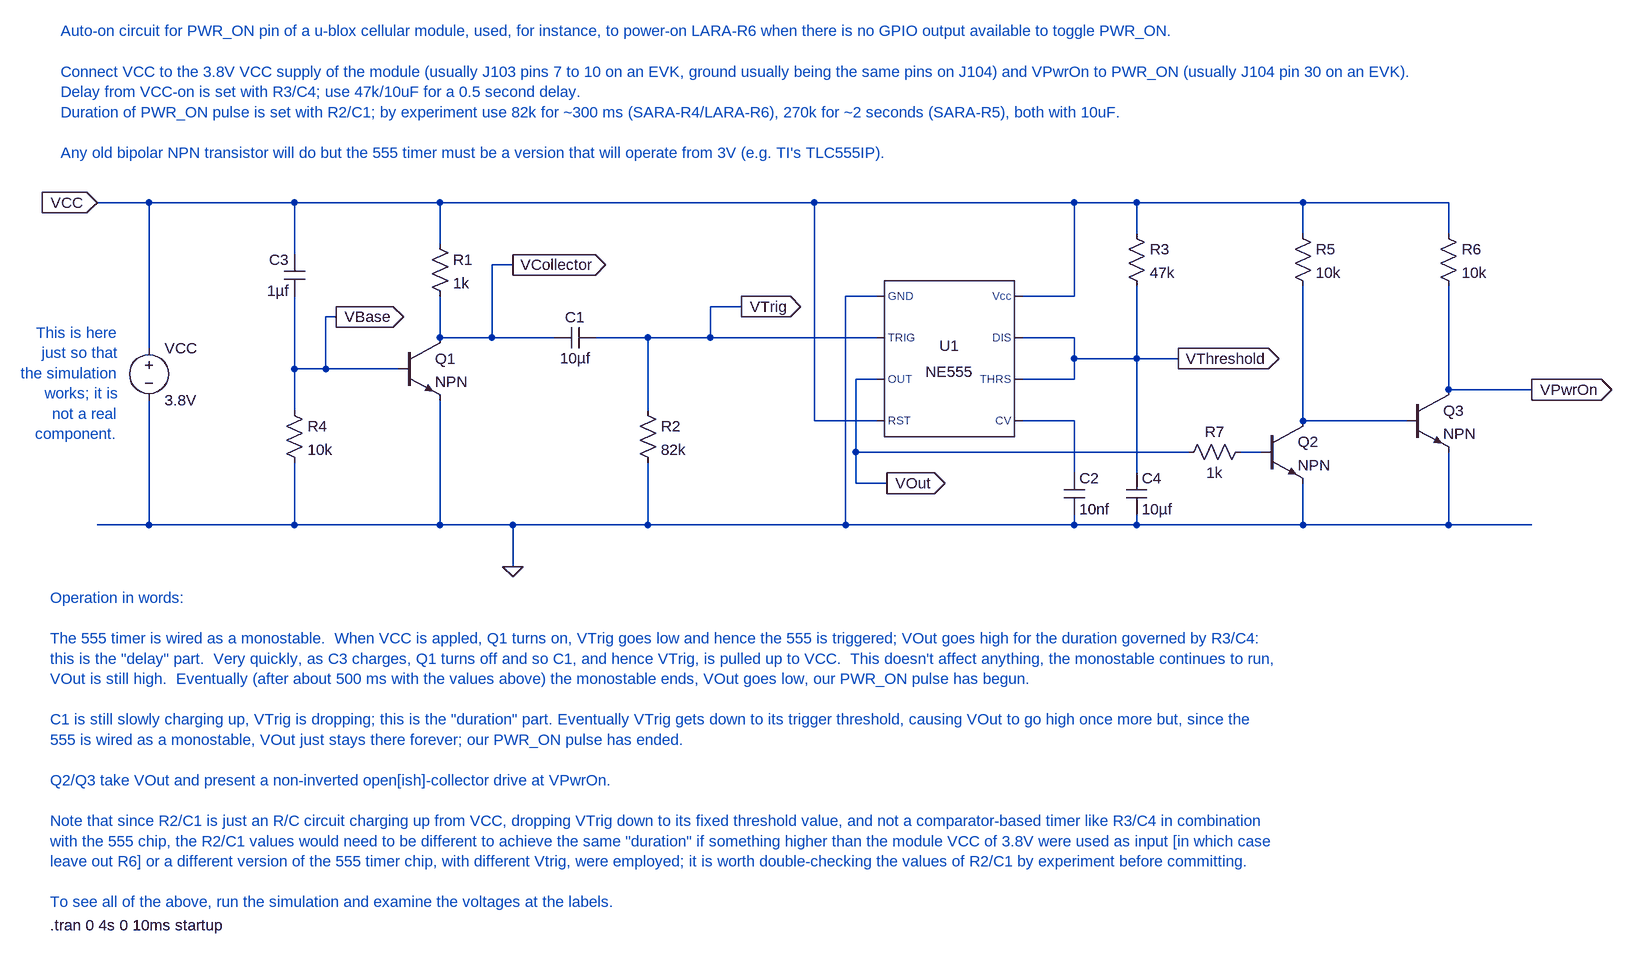
[diagram p0: schematic cellular_auto_pwr_on_schematic.asc]
cellular_auto_pwr_on_schematic.asc, the LTspice schematic file:
Version 4
SHEET 1 2436 1064
WIRE -288 -64 -368 -64
WIRE -64 -64 -288 -64
WIRE 160 -64 -64 -64
WIRE 736 -64 160 -64
WIRE 1136 -64 736 -64
WIRE 1232 -64 1136 -64
WIRE 1488 -64 1232 -64
WIRE 1712 -64 1488 -64
WIRE 1232 -16 1232 -64
WIRE 1488 -16 1488 -64
WIRE 1712 -16 1712 -64
WIRE 160 0 160 -64
WIRE -64 16 -64 -64
WIRE 272 32 240 32
WIRE 832 80 784 80
WIRE 1136 80 1136 -64
WIRE 1136 80 1056 80
WIRE 624 96 576 96
WIRE 0 112 -16 112
WIRE 160 144 160 80
WIRE 240 144 240 32
WIRE 240 144 160 144
WIRE 336 144 240 144
WIRE 480 144 400 144
WIRE 576 144 576 96
WIRE 576 144 480 144
WIRE 832 144 576 144
WIRE 1136 144 1056 144
WIRE -288 160 -288 -64
WIRE 1136 176 1136 144
WIRE 1232 176 1232 64
WIRE 1232 176 1136 176
WIRE 1296 176 1232 176
WIRE -64 192 -64 80
WIRE -16 192 -16 112
WIRE -16 192 -64 192
WIRE 96 192 -16 192
WIRE 832 208 800 208
WIRE 1136 208 1136 176
WIRE 1136 208 1056 208
WIRE 1712 224 1712 64
WIRE 1840 224 1712 224
WIRE -64 256 -64 192
WIRE 480 256 480 144
WIRE 736 272 736 -64
WIRE 832 272 736 272
WIRE 1136 272 1056 272
WIRE 1488 272 1488 64
WIRE 1648 272 1488 272
WIRE 800 320 800 208
WIRE 1312 320 800 320
WIRE 1424 320 1392 320
WIRE 1136 352 1136 272
WIRE 1232 352 1232 176
WIRE 800 368 800 320
WIRE 848 368 800 368
WIRE -288 432 -288 240
WIRE -288 432 -368 432
WIRE -64 432 -64 336
WIRE -64 432 -288 432
WIRE 160 432 160 240
WIRE 160 432 -64 432
WIRE 272 432 160 432
WIRE 480 432 480 336
WIRE 480 432 272 432
WIRE 784 432 784 80
WIRE 784 432 480 432
WIRE 1136 432 1136 416
WIRE 1136 432 784 432
WIRE 1232 432 1232 416
WIRE 1232 432 1136 432
WIRE 1488 432 1488 368
WIRE 1488 432 1232 432
WIRE 1712 432 1712 320
WIRE 1712 432 1488 432
WIRE 1840 432 1712 432
WIRE 272 496 272 432
FLAG 272 496 0
FLAG -368 -64 VCC
IOPIN -368 -64 In
FLAG 1840 224 VPwrOn
IOPIN 1840 224 Out
FLAG 624 96 VTrig
IOPIN 624 96 Out
FLAG 272 32 VCollector
IOPIN 272 32 Out
FLAG 1296 176 VThreshold
IOPIN 1296 176 Out
FLAG 0 112 VBase
IOPIN 0 112 Out
FLAG 848 368 VOut
IOPIN 848 368 Out
SYMBOL npn 96 144 R0
SYMATTR InstName Q1
SYMBOL cap 400 128 R90
WINDOW 0 0 32 VBottom 2
WINDOW 3 32 32 VTop 2
SYMATTR InstName C1
SYMATTR Value 10µf
SYMBOL res 144 -16 R0
SYMATTR InstName R1
SYMATTR Value 1k
SYMBOL res -80 240 R0
SYMATTR InstName R4
SYMATTR Value 10k
SYMBOL voltage -288 144 R0
WINDOW 123 0 0 Left 0
WINDOW 39 24 124 Left 2
SYMATTR InstName VCC
SYMATTR Value 3.8V
SYMBOL cap -48 80 R180
WINDOW 0 24 56 Left 2
WINDOW 3 24 8 Left 2
SYMATTR InstName C3
SYMATTR Value 1µf
SYMBOL res 464 240 R0
SYMATTR InstName R2
SYMATTR Value 82k
SYMBOL Misc\\NE555 944 176 R0
SYMATTR InstName U1
SYMBOL cap 1120 352 R0
SYMATTR InstName C2
SYMATTR Value 10nf
SYMBOL res 1216 -32 R0
SYMATTR InstName R3
SYMATTR Value 47k
SYMBOL cap 1216 352 R0
SYMATTR InstName C4
SYMATTR Value 10µf
SYMBOL npn 1424 272 R0
SYMATTR InstName Q2
SYMBOL res 1472 -32 R0
SYMATTR InstName R5
SYMATTR Value 10k
SYMBOL npn 1648 224 R0
SYMATTR InstName Q3
SYMBOL res 1696 -32 R0
SYMATTR InstName R6
SYMATTR Value 10k
SYMBOL res 1408 304 R90
WINDOW 0 0 56 VBottom 2
WINDOW 3 32 56 VTop 2
SYMATTR InstName R7
SYMATTR Value 1k
TEXT -440 1048 Left 2 !.tran 0 4s 0 10ms startup
TEXT -424 -328 Left 2 ;Auto-on circuit for PWR_ON pin of a u-blox cellular module, used, for instance, to power-on LARA-R6 when there is no GPIO output available to toggle PWR_ON.\n \nConnect VCC to the 3.8V VCC supply of the module (usually J103 pins 7 to 10 on an EVK, ground usually being the same pins on J104) and VPwrOn to PWR_ON (usually J104 pin 30 on an EVK).\nDelay from VCC-on is set with R3/C4; use 47k/10uF for a 0.5 second delay.\nDuration of PWR_ON pulse is set with R2/C1; by experiment use 82k for ~300 ms (SARA-R4/LARA-R6), 270k for ~2 seconds (SARA-R5), both with 10uF.\n \nAny old bipolar NPN transistor will do but the 555 timer must be a version that will operate from 3V (e.g. TI's TLC555IP).
TEXT -440 544 Left 2 ;Operation in words:\n \nThe 555 timer is wired as a monostable.  When VCC is appled, Q1 turns on, VTrig goes low and hence the 555 is triggered; VOut goes high for the duration governed by R3/C4:\nthis is the "delay" part.  Very quickly, as C3 charges, Q1 turns off and so C1, and hence VTrig, is pulled up to VCC.  This doesn't affect anything, the monostable continues to run,\nVOut is still high.  Eventually (after about 500 ms with the values above) the monostable ends, VOut goes low, our PWR_ON pulse has begun.\n \nC1 is still slowly charging up, VTrig is dropping; this is the "duration" part. Eventually VTrig gets down to its trigger threshold, causing VOut to go high once more but, since the\n555 is wired as a monostable, VOut just stays there forever; our PWR_ON pulse has ended.\n \nQ2/Q3 take VOut and present a non-inverted open[ish]-collector drive at VPwrOn.\n \nNote that since R2/C1 is just an R/C circuit charging up from VCC, dropping VTrig down to its fixed threshold value, and not a comparator-based timer like R3/C4 in combination\nwith the 555 chip, the R2/C1 values would need to be different to achieve the same "duration" if something higher than the module VCC of 3.8V were used as input [in which case\nleave out R6] or a different version of the 555 timer chip, with different Vtrig, were employed; it is worth double-checking the values of R2/C1 by experiment before committing.\n \nTo see all of the above, run the simulation and examine the voltages at the labels.
TEXT -336 136 Right 2 ;This is here\njust so that\nthe simulation\nworks; it is\nnot a real\ncomponent.

The netlist it stands for:
* cellular_auto_pwr_on_schematic.asc
Q1 VCollector VBase 0 0 NPN
C1 VTrig VCollector 10µf
R1 VCC VCollector 1k
R4 VBase 0 10k
VCC VCC 0 3.8V
C3 VBase VCC 1µf
R2 VTrig 0 82k
XU1 0 VTrig VOut VCC N001 VThreshold VThreshold VCC NE555  ; pins GND TRIG OUT RST CV THRS DIS Vcc
C2 N001 0 10nf
R3 VCC VThreshold 47k
C4 VThreshold 0 10µf
Q2 N002 N003 0 0 NPN
R5 VCC N002 10k
Q3 VPwrOn N002 0 0 NPN
R6 VCC VPwrOn 10k
R7 N003 VOut 1k
.model NPN NPN
.model PNP PNP
.lib standard.bjt
.tran 0 4s 0 10ms startup
* Auto-on circuit for PWR_ON pin of a u-blox cellular module, used, for instance, to power-on LARA-R6 when there is no GPIO output available to toggle PWR_ON.
* Connect VCC to the 3.8V VCC supply of the module (usually J103 pins 7 to 10 on an EVK, ground usually being the same pins on J104) and VPwrOn to PWR_ON (usually J104 pin 30 on an EVK).
* Delay from VCC-on is set with R3/C4; use 47k/10uF for a 0.5 second delay.
* Duration of PWR_ON pulse is set with R2/C1; by experiment use 82k for ~300 ms (SARA-R4/LARA-R6), 270k for ~2 seconds (SARA-R5), both with 10uF.
* Any old bipolar NPN transistor will do but the 555 timer must be a version that will operate from 3V (e.g. TI's TLC555IP).
* Operation in words:
* The 555 timer is wired as a monostable.  When VCC is appled, Q1 turns on, VTrig goes low and hence the 555 is triggered; VOut goes high for the duration governed by R3/C4:
* this is the "delay" part.  Very quickly, as C3 charges, Q1 turns off and so C1, and hence VTrig, is pulled up to VCC.  This doesn't affect anything, the monostable continues to run,
* VOut is still high.  Eventually (after about 500 ms with the values above) the monostable ends, VOut goes low, our PWR_ON pulse has begun.
* C1 is still slowly charging up, VTrig is dropping; this is the "duration" part. Eventually VTrig gets down to its trigger threshold, causing VOut to go high once more but, since the
* 555 is wired as a monostable, VOut just stays there forever; our PWR_ON pulse has ended.
* Q2/Q3 take VOut and present a non-inverted open[ish]-collector drive at VPwrOn.
* Note that since R2/C1 is just an R/C circuit charging up from VCC, dropping VTrig down to its fixed threshold value, and not a comparator-based timer like R3/C4 in combination
* with the 555 chip, the R2/C1 values would need to be different to achieve the same "duration" if something higher than the module VCC of 3.8V were used as input [in which case
* leave out R6] or a different version of the 555 timer chip, with different Vtrig, were employed; it is worth double-checking the values of R2/C1 by experiment before committing.
* To see all of the above, run the simulation and examine the voltages at the labels.
* This is here
* just so that
* the simulation
* works; it is
* not a real
* component.
.lib NE555.sub
.backanno
.end